# EAGLE design stm32rf_node (EAGLE 8.1.1)
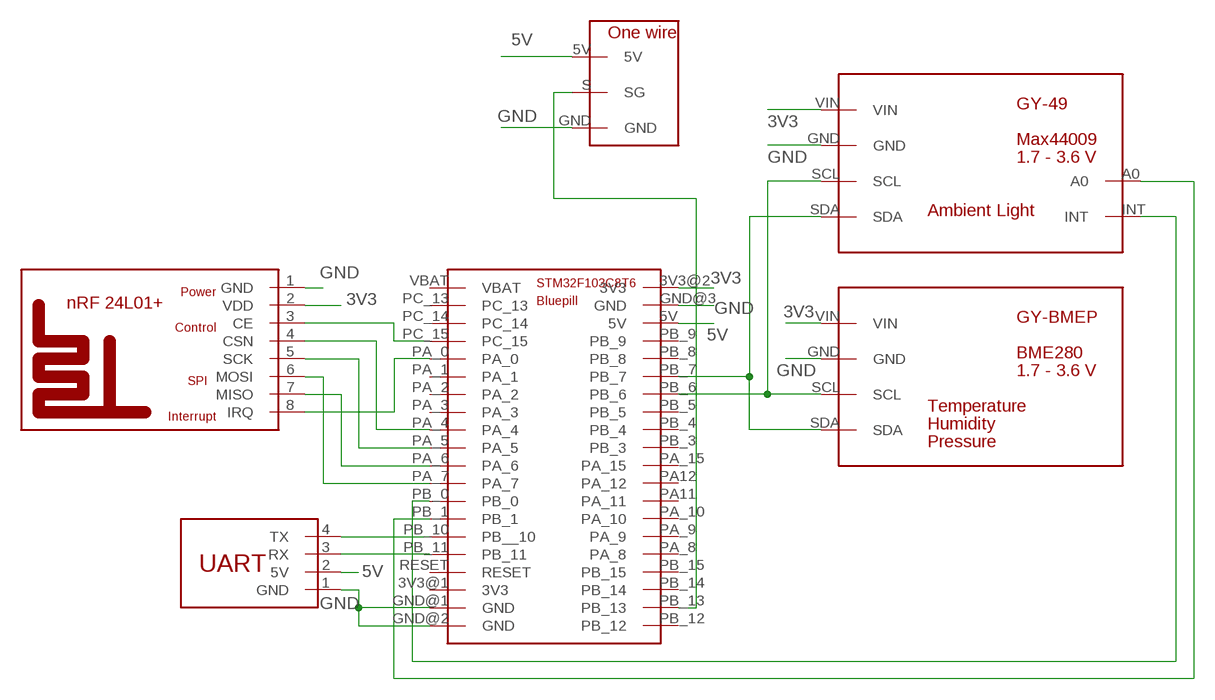
[diagram p0: schematic, sheet 1]

## Parts
U$1  STM32_BLUEPILL  [STM32_BLUEPILL]
U$2  NRF24L01+REFDESIGNMINI  [NRF24L01+REFDESIGN-MINI]
U$3  GY-BMEPGY-BMEP-NOHOLE  [GY-BMEP-NOHOLE]
U$4  GY-49G-49-SURF  [GY-49-SURF]
U$5  ONE_WIRE'RIGHT'  [ONE_WIRE_RIGHT]
U$6  UARTMINI  [UART-MINI]

## Nets
3V3: U$1.3V3@2(3V3) U$2.2(VDD) U$3.VIN U$4.VIN
5V: U$1.5V U$5.5V U$6.2(5V)
GND: U$1.GND@1(GND) U$1.GND@2(GND) U$1.GND@3(GND) U$2.1(GND) U$3.GND U$4.GND U$5.GND U$6.1(GND)
INT: U$1.PB_0 U$4.INT
N$1: U$1.PA_7 U$2.6(MOSI)
N$2: U$1.PA_6 U$2.7(MISO)
N$3: U$1.PA_5 U$2.5(SCK)
N$4: U$1.PA_4 U$2.4(CSN)
N$5: U$1.PB_1 U$4.A0
N$6: U$1.PA_0 U$2.8(IRQ)
N$7: U$1.PB_10(PB__10) U$6.4(TX)
N$8: U$1.PB_11 U$6.3(RX)
N$9: U$1.PB_6 U$3.SCL U$4.SCL
N$10: U$1.PB_7 U$3.SDA U$4.SDA
N$11: U$1.PC_15 U$2.3(CE)
N$12: U$1.PB_13 U$5.S(SG)
Unconnected: U$1.3V3@1(3V3) U$1.PA11(PA_11) U$1.PA12(PA_12) U$1.PA_1 U$1.PA_2 U$1.PA_3 U$1.PA_8 U$1.PA_9 U$1.PA_10 U$1.PA_15 U$1.PB_3 U$1.PB_4 U$1.PB_5 U$1.PB_8 U$1.PB_9 U$1.PB_12 U$1.PB_14 U$1.PB_15 U$1.PC_13 U$1.PC_14 U$1.RESET U$1.VBAT

## Library data of the parts
U$1 = stm32_bluepill:STM32_BLUEPILL
U$2 = nRF24L01+RefDesign:NRF24L01+REFDESIGN
U$3 = GY-BMEP:GY-BMEP
U$4 = GY-49:GY-49
U$5 = one-wire:ONE_WIRE
U$6 = WFConnectors:UART

## Board
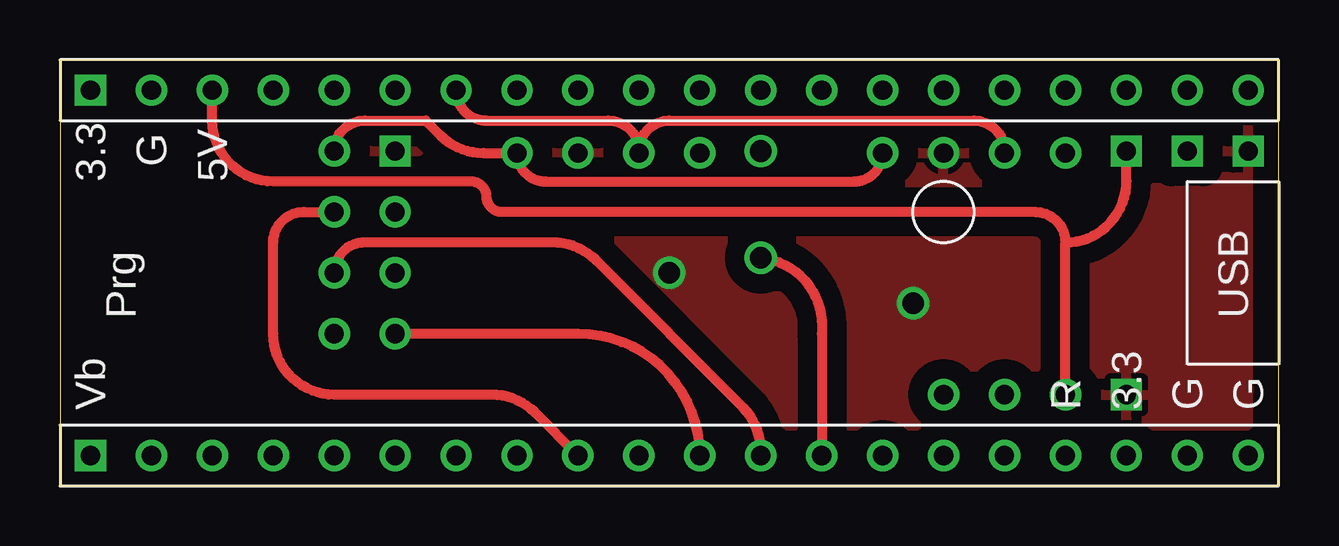
[diagram p1: board, top side]
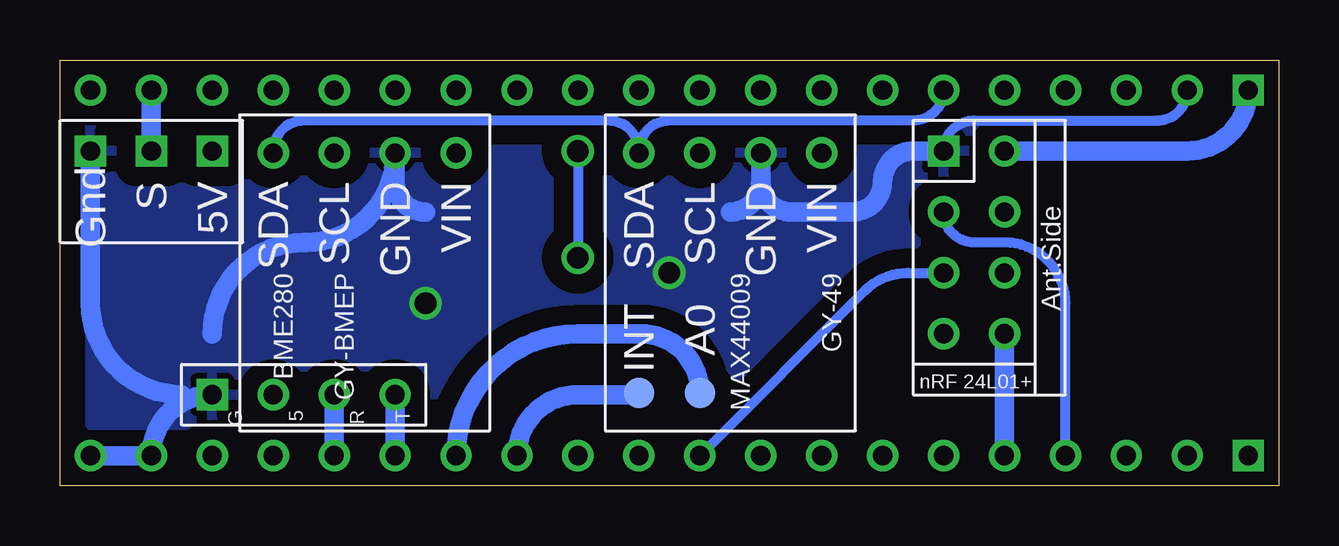
[diagram p2: board, bottom side, seen from below]

Size 50.8 x 17.77 mm. Coordinates in mm from the lower left corner, seen from the top.
Outline: 0,0 50.8,0 50.8,17.77 0,17.77 0,0
Copper layers (1*16): Top 0.035mm / dielectric 1.5mm / Bottom 0.035mm
Design rules "EagleRules": minimum track width 7mil, minimum drill 12mil, track to track 7mil, track to pad 7mil, pad to pad 7mil, via to via 7mil, smd to smd 0mil, copper to edge 20mil, drill to drill 10mil, minimum pad ring 10mil, minimum via ring 6mil, stop-mask expansion 2mil, vias tented up to drill 25mil, thermal gap 10mil

### Footprints (pad centres in the part's own frame; a part is rotated, then mirrored left to right if it is on the bottom)
STM32_BLUEPILL = drill 0.8: 3V3@1 -7.62,-19.05; 5V 7.62,19.05; GND@1 -7.62,-21.59; GND@2 -7.62,-24.13; GND@3 7.62,21.59; PA11 7.62,-6.35; PA12 7.62,-3.81; PA_0 -7.62,13.97; PA_1 -7.62,11.43; PA_2 -7.62,8.89; PA_3 -7.62,6.35; PA_4 -7.62,3.81; PA_5 -7.62,1.27; PA_6 -7.62,-1.27; PA_7 -7.62,-3.81; PA_8 7.62,-13.97; PA_9 7.62,-11.43; PA_10 7.62,-8.89; PA_15 7.62,-1.27; PB_0 -7.62,-6.35; PB_1 -7.62,-8.89; PB_3 7.62,1.27; PB_4 7.62,3.81; PB_5 7.62,6.35; PB_6 7.62,8.89; PB_7 7.62,11.43; PB_8 7.62,13.97; PB_9 7.62,16.51; PB_10 -7.62,-11.43; PB_11 -7.62,-13.97; PB_12 7.62,-24.13; PB_13 7.62,-21.59; PB_14 7.62,-19.05; PB_15 7.62,-16.51; PC_13 -7.62,21.59; PC_14 -7.62,19.05; PC_15 -7.62,16.51; RESET -7.62,-16.51 | drill 0.8 square: 3V3@2 7.62,24.13; VBAT -7.62,24.13
NRF24L01+REFDESIGN-MINI = drill 0.8 square: 1 -1.27,3.81 | drill 0.8: 2 1.27,3.81; 3 -1.27,1.27; 4 1.27,1.27; 5 -1.27,-1.27; 6 1.27,-1.27; 7 -1.27,-3.81; 8 1.27,-3.81
GY-BMEP-NOHOLE = drill 0.8: GND -5,1.27; SCL -5,-1.27; SDA -5,-3.81; VIN -5,3.81
GY-49-SURF = smd 1.27 x 1.27: A0 5,-1.27; INT 5,-3.81 | drill 0.8: GND -5,1.27; SCL -5,-1.27; SDA -5,-3.81; VIN -5,3.81
ONE_WIRE_RIGHT = drill 0.8 square: 5V 0,2.54; GND 0,-2.54; S 0,0
UART-MINI = drill 0.8 square: 1 0,0 | drill 0.8: 2 0,2.54; 3 0,5.08; 4 0,7.62

### Placement (x,y rotation side)
U$1  25.4,8.89 90 top
U$2  12.7,10.16 0 bottom
U$3  38.1,8.89 270 bottom
U$4  22.86,8.89 270 bottom
U$5  46.99,13.97 270 bottom
U$6  44.45,3.81 270 bottom

### Tracks (layer width: path | path; a pad name or v marks a point on that pad's centre or on a via)
3V3
  Top 0.406: U$2.2 arc-90 12.7,15.24 15.24,15.24 15.85,14.63 arc45 17.64,13.89 U$4.VIN arc90 20.24,12.7 33.1,12.7 arc90 U$3.VIN
  Bottom 0.813: U$2.2 3.81,13.97 arc-90 U$1.3V3@2
5V
  Top 0.406: 41.91,10.16 arc90 40.64,11.43 18.41,11.43 arc-90 17.78,12.06 arc90 17.14,12.7 8.89,12.7 arc-90 6.35,15.24 U$1.5V | U$6.2 41.91,10.16 | 41.91,10.16 arc90 44.45,12.7 U$5.5V
GND  (via drill 0.9)
  Bottom 0.406: U$2.1 arc90 12.7,15.24 5.08,15.24 arc-90 U$1.GND@3
  Bottom 0.813: U$1.GND@2 U$1.GND@1 arc90 U$6.1 | 45.72,3.81 arc90 49.53,7.62 U$5.GND | 44.45,6.35 arc90 40.64,10.16 40.56,10.16 arc-90 U$3.GND 36.83,12.7 arc-90 35.56,11.43 | 22.86,11.43 arc-90 21.59,12.7 | U$4.GND 21.59,12.7 | 21.59,12.7 arc-90 20.32,11.43 17.78,11.43 arc-90 16.51,12.7 arc90 15.24,13.97 U$2.1
  other vias: 35.56,7.62 25.4,8.89
  pour Bottom (isolate 0.813): 8.89,15.24 8.89,2.54 49.53,2.54 49.53,15.24
  pour Top (isolate 0.813): 8.89,15.24 8.89,2.54 49.53,2.54 49.53,15.24
INT  (via drill 0.9)
  Top 0.406: v29.21,9.53 arc-90 31.75,6.35 U$1.PB_0
  Bottom 0.406: v29.21,13.97 v29.21,9.53
  Bottom 0.813: U$1.PB_0 arc90 29.21,3.81 26.75,3.81 arc-90 U$4.INT
N$1
  Top 0.406: U$2.6 arc-90 12.7,10.16 20.54,10.16 arc-45 22.33,9.42 28.47,3.28 arc-45 29.21,1.49 U$1.PA_7
N$2
  Top 0.406: U$1.PA_6 arc90 21.59,6.35 U$2.7
N$3
  Bottom 0.406: U$2.5 15.46,8.89 arc-45 17.25,8.15 U$1.PA_5
N$4
  Top 0.406: U$1.PA_4 19.79,3.07 arc45 18,3.81 11.43,3.81 arc-90 8.89,6.35 8.89,10.16 arc-90 10.16,11.43 U$2.4
N$5
  Bottom 0.813: U$1.PB_1 arc90 29.21,6.35 26.59,6.35 arc90 U$4.A0
N$6
  Bottom 0.813: U$1.PA_0 U$2.8
N$7
  Bottom 0.813: U$6.4 U$1.PB_10
N$8
  Bottom 0.813: U$6.3 U$1.PB_11
N$9
  Top 0.406: U$1.PB_6 arc90 17.78,15.24 22.86,15.24 arc-90 24.13,13.97 | 24.13,13.97 U$4.SCL 24.13,13.97 | 24.13,13.97 arc-90 25.4,15.24 38.1,15.24 arc-90 39.37,13.97 U$3.SCL
N$10
  Bottom 0.406: U$1.PB_7 arc90 15.24,15.24 25.4,15.24 arc-90 26.67,13.97 | 26.67,13.97 U$4.SDA 26.67,13.97 | 26.67,13.97 arc-90 27.94,15.24 40.64,15.24 arc-90 41.91,13.97 U$3.SDA
N$11
  Bottom 0.406: U$1.PC_15 8.89,7.62 arc-90 11.43,10.16 12.7,10.16 arc90 U$2.3
N$12
  Bottom 0.813: U$1.PB_13 U$5.S